# Altium schematic sheet interface_eagle_1.SchDoc
size 243 x 156 mm
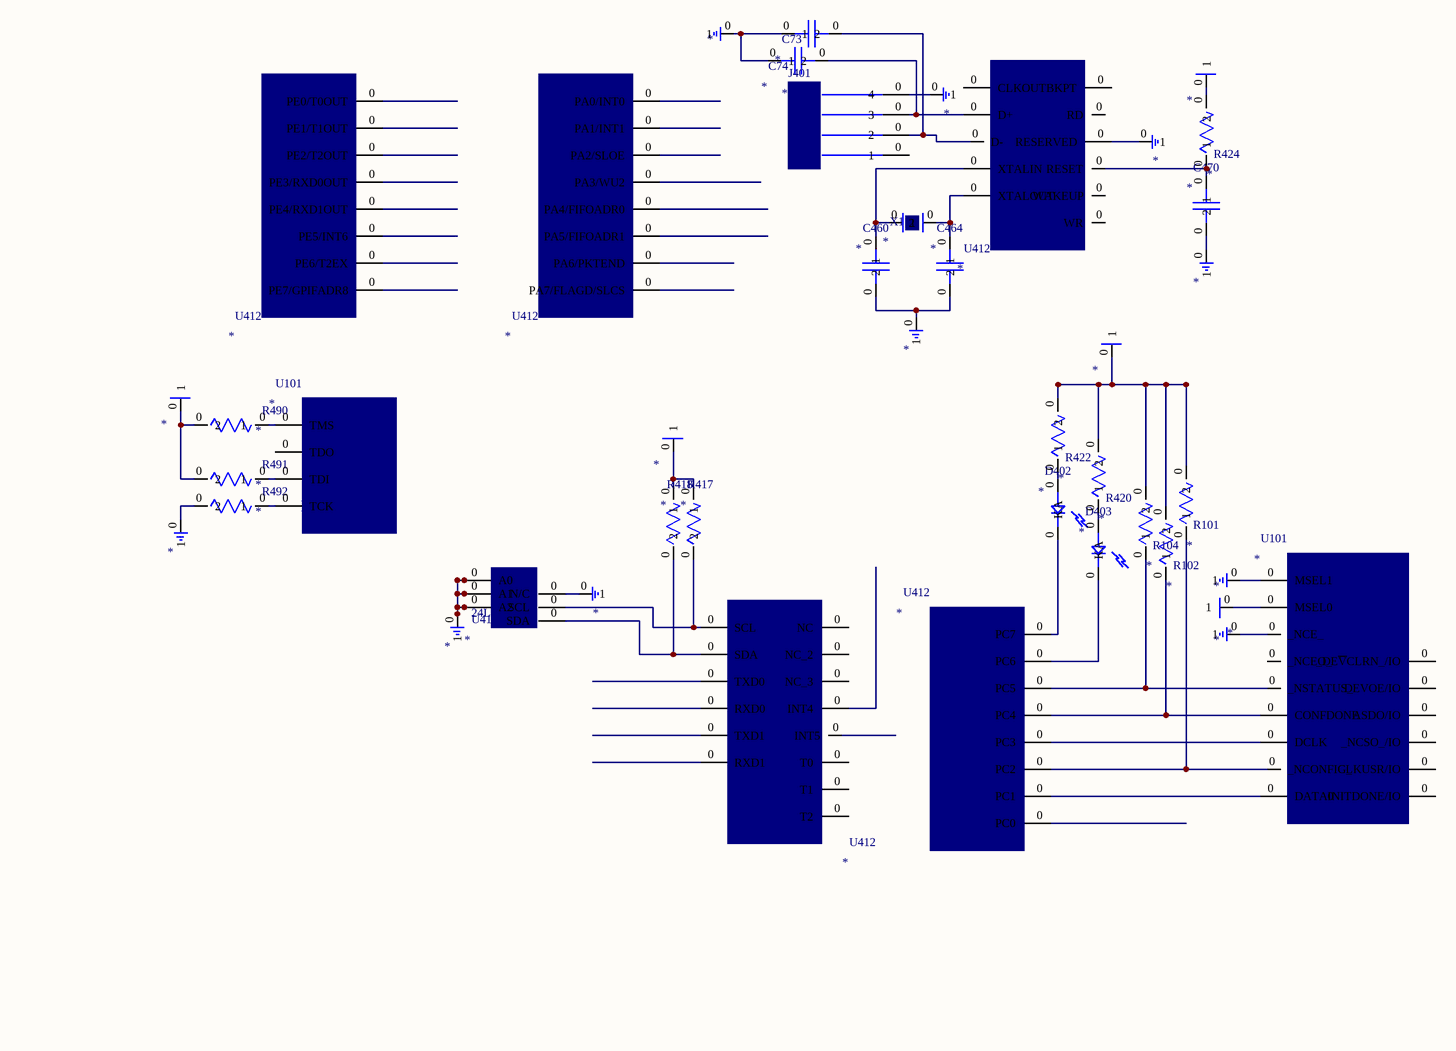
[diagram p0: interface_eagle_1.SchDoc]

## Parts
C73  *
C74  *
C460  *
C464  *
C470  *
D402  *
D403  *
GENERIC-POWER  *
GENERIC-POWER-4  *
GENERIC-POWER-9  *
GENERIC-POWER-10  *
GENERIC-POWER-14  *
GND-1  *
GND-1-3  *
GND-1-5  *
GND-1-6  *
GND-1-7  *
GND-1-8  *
GND-1-11  *
GND-1-12  *
GND-1-13  *
GND-1-17  *
J401  *
R101  *
R102  *
R104  *
R417  *
R418  *
R420  *
R422  *
R424  *
R490  *
R491  *
R492  *
U101  *
U101-2  *
U412  *
U412-0  *
U412-1  *
U412-15  *
U412-16  *
U413  *
X1  *

## Nets
NetC73_0: C73.0(1) C74.0(1) GND-1-17.0(1)
NetC73_0: C73.0(2) J401.0(1) U412.0(D-)  [a separate net that carries the same name]
NetC74_0: C74.0(2) J401.0(3) U412.0(BKPT)
NetC460_0: C460.0(1) U412.0(XTALIN) X1.0(1)
NetC460_0: C460.0(2) C464.0(2) GND-1-6.0(1)  [a separate net that carries the same name]
NetC464_0: C464.0(1) U412.0(XTALOUT) X1.0(2)
NetC470_0: C470.0(1) R424.0(1) U412.0(RESET)
NetC470_0: C470.0(2) GND-1-8.0(1)  [a separate net that carries the same name]
NetD402_0: D402.0(A) R422.0(1)
NetD402_0: D402.0(K) U412-1.0(PC7)  [a separate net that carries the same name]
NetD403_0: D403.0(A) R420.0(1)
NetD403_0: D403.0(K) U412-1.0(PC6)  [a separate net that carries the same name]
NetGENERIC-POWER-4_0: GENERIC-POWER-4.0(1) R101.0(2) R102.0(2) R104.0(2) R420.0(2) R422.0(2)
NetGENERIC-POWER-9_0: GENERIC-POWER-9.0(1) R424.0(2)
NetGENERIC-POWER-10_0: GENERIC-POWER-10.0(1) R490.0(2) R491.0(2)
NetGENERIC-POWER-14_0: GENERIC-POWER-14.0(1) R417.0(1) R418.0(1)
NetGENERIC-POWER_0: GENERIC-POWER.0(1) U101.0(MSEL0)
NetGND-1-3_0: GND-1-3.0(1) U101.0(MSEL1)
NetGND-1-5_0: GND-1-5.0(1) J401.0(4)
NetGND-1-7_0: GND-1-7.0(1) U412.0(RESERVED)
NetGND-1-11_0: GND-1-11.0(1) R492.0(2)
NetGND-1-12_0: GND-1-12.0(1) U413.0(N/C)
NetGND-1-13_0: GND-1-13.0(1) U413.0(A0)
NetGND-1_0: GND-1.0(1) U101.0(_NCE_)
NetR101_0: R101.0(1) U101.0(_NCONFIG_) U412-1.0(PC2)
NetR102_0: R102.0(1) U101.0(ASDO/IO) U412-1.0(PC4)
NetR104_0: R104.0(1) U101.0(_NSTATUS_) U412-1.0(PC5)
NetR417_0: R417.0(2) U412-0.0(INT4) U413.0(SCL)
NetR418_0: R418.0(2) U412-0.0(SDA) U413.0(SDA)
NetR490_0: R490.0(1) U101-2.0(TMS)
NetR491_0: R491.0(1) U101-2.0(TDI)
NetR492_0: R492.0(1) U101-2.0(TCK)
NetU101_0: U101.0(DATA0) U412-1.0(PC0)
NetU101_0: U101.0(DCLK) U412-1.0(PC3)  [a separate net that carries the same name]

Not connected (* = marked no-connect by the designer): U412-15 0(PA0/INT0); U412-16 0(PE0/T0OUT)

## Notes on the sheet
- (in symbol 24CXX-1) 24LC02B
- (in symbol CY7C68013-TQ100-MISC_MIRRORED) U412
- (in symbol CY7C68013-TQ100-PA) U412
- (in symbol CY7C68013-TQ100-PC_MIRRORED) U412
- (in symbol CY7C68013-TQ100-PE) U412
- (in symbol EP1C12-PQ240-JTAG_MIRRORED) U101

## Library data of the parts
C73 C74 C460 C464 C470 = CAPACITOR-1
D402 D403 = LED-1
GENERIC-POWER GENERIC-POWER-4 GENERIC-POWER-9 GENERIC-POWER-10 GENERIC-POWER-14 = GENERIC-POWER
GND-1 GND-1-3 GND-1-5-GND-1-8 GND-1-11-GND-1-13 GND-1-17 = GND-1
J401 = CONNECTOR4-1_MIRRORED
R101 R102 R104 R417 R418 R420 R422 R424 R490-R492 = RESISTOR-1
U101 = EP1C12-PQ240-CFG_MIRRORED
U101-2 = EP1C12-PQ240-JTAG_MIRRORED
U412 = CY7C68013-TQ100-CTRL
U412-0 = CY7C68013-TQ100-MISC_MIRRORED
U412-1 = CY7C68013-TQ100-PC_MIRRORED
U412-15 = CY7C68013-TQ100-PA
U412-16 = CY7C68013-TQ100-PE
U413 = 24CXX-1
X1 = CRYSTAL-1